# EAGLE design fpc (EAGLE 7.4.0)
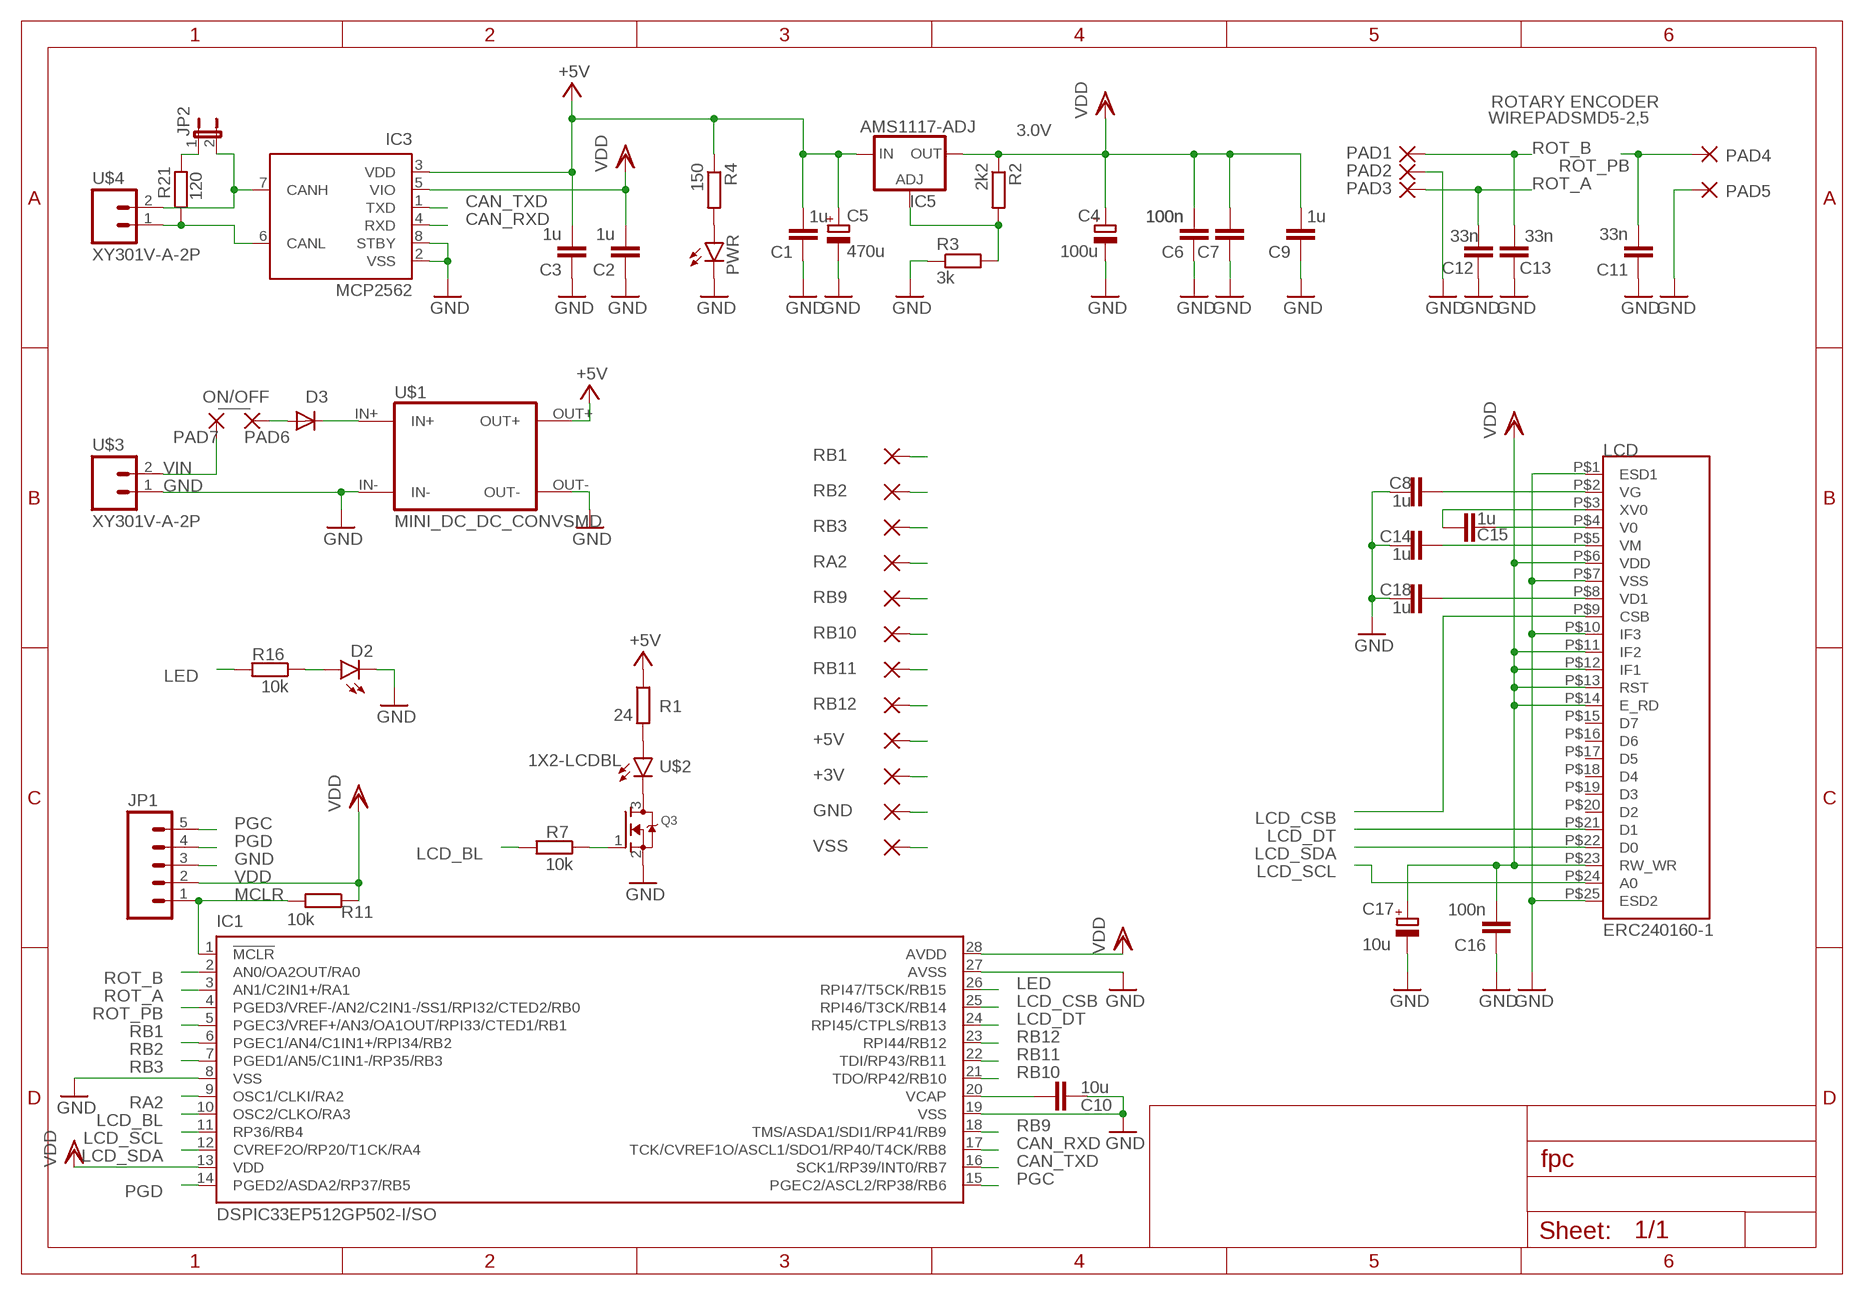
[diagram p0: schematic, sheet 1]

## Parts
+3V  WIREPADSMD1,27-254  [SMD1,27-2,54]
+5V  WIREPADSMD1,27-254  [SMD1,27-2,54]
C1  1u  C-EUC0603K  [C0603K]
C2  1u  C-EUC0603K  [C0603K]
C3  1u  C-EUC0603K  [C0603K]
C4  100u  CPOL-EUSANYO_SMD_B6  [SANYO-OSCON_SMD_B6]
C5  470u  CPOL-EUSANYO_SMD_B6  [SANYO-OSCON_SMD_B6]
C6  100n  C-EUC0603K  [C0603K]
C7  100n  C-EUC0603K  [C0603K]
C8  1u  C-EUC0603K  [C0603K]
C9  1u  C-EUC0603K  [C0603K]
C10  10u  C-EUC0805  [C0805]
C11  33n  C-EUC0603K  [C0603K]
C12  33n  C-EUC0603K  [C0603K]
C13  33n  C-EUC0603K  [C0603K]
C14  1u  C-EUC0603K  [C0603K]
C15  1u  C-EUC0603K  [C0603K]
C16  100n  C-EUC0603K  [C0603K]
C17  10u  CPOL-EUSANYO_SMD_E12  [SANYO-OSCON_SMD_E12]
C18  1u  C-EUC0603K  [C0603K]
D2  LED-FKIT-1206  [FKIT-LED-1206]
D3  DIODESMA  [SMADIODE]
GND  WIREPADSMD1,27-254  [SMD1,27-2,54]
IC1  DSPIC33EP512GP502-I/SO  [SO28W]
IC3  MCP2562  MCP2562-E/SN  [SO-08]
IC5  AMS1117-ADJ  LD117AS33TR  [SOT223]
JP1  M05PTH  [1X05]
JP2  JP1E  [JP1]
LCD  ERC240160-1  [1X25-LCDFPC-SMD]
PAD1  WIREPADSMD5-2,5  [5-2,5]
PAD2  WIREPADSMD5-2,5  [5-2,5]
PAD3  WIREPADSMD5-2,5  [5-2,5]
PAD4  WIREPADSMD5-2,5  [5-2,5]
PAD5  WIREPADSMD5-2,5  [5-2,5]
PAD6  WIREPADSMD5-2,5  [5-2,5]
PAD7  WIREPADSMD5-2,5  [5-2,5]
PWR  LED-FKIT-1206  [FKIT-LED-1206]
Q3  MOSFET-NREFLOW  [SOT23]
R1  24  R-EU_R0805  [R0805]
R2  2k2  R-EU_R0603  [R0603]
R3  3k  R-EU_R0603  [R0603]
R4  150  R-EU_R0603  [R0603]
R7  10k  R-EU_R0603  [R0603]
R11  10k  R-EU_R0603  [R0603]
R16  10k  R-EU_R0603  [R0603]
R21  120  R-EU_R0603  [R0603]
RA2  WIREPADSMD1,27-254  [SMD1,27-2,54]
RB1  WIREPADSMD1,27-254  [SMD1,27-2,54]
RB2  WIREPADSMD1,27-254  [SMD1,27-2,54]
RB3  WIREPADSMD1,27-254  [SMD1,27-2,54]
RB9  WIREPADSMD1,27-254  [SMD1,27-2,54]
RB10  WIREPADSMD1,27-254  [SMD1,27-2,54]
RB11  WIREPADSMD1,27-254  [SMD1,27-2,54]
RB12  WIREPADSMD1,27-254  [SMD1,27-2,54]
U$1  MINI_DC_DC_CONVSMD  [DSN-MINI-360-SMD]
U$2  1X2-LCDBL  [1X2-LCDBL-SMD]
U$3  XY301V-A-2P  [XY301V-A-2P]
U$4  XY301V-A-2P  [XY301V-A-2P]
VSS  WIREPADSMD1,27-254  [SMD1,27-2,54]

## Nets
+5V: +5V.1(P) C1.2 C3.2 C5.+ IC3.3(VDD) IC5.3(IN) R1.1 R4.1 U$1.OUT+
CAN_H: IC3.7(CANH) JP2.2 U$4.2
CAN_L: IC3.6(CANL) R21.1 U$4.1
CAN_RXD: IC1.17(TCK/CVREF1O/ASCL1/SDO1/RP40/T4CK/RB8) IC3.4(RXD)
CAN_TXD: IC1.16(SCK1/RP39/INT0/RB7) IC3.1(TXD)
GND: C1.1 C2.1 C3.1 C4.- C5.- C6.1 C7.1 C8.1 C9.1 C10.1 C11.1 C12.1 C13.1 C14.1 C16.1 C17.- C18.1 D2.C GND.1(P) IC1.8(VSS) IC1.19(VSS) IC1.27(AVSS) IC3.2(VSS) IC3.8(STBY) JP1.3 LCD.P$1(ESD1) LCD.P$7(VSS) LCD.P$10(IF3) LCD.P$25(ESD2) PAD2.1(P) PAD5.1(P) PWR.C Q3.2(S) R3.1 U$1.IN- U$1.OUT- U$3.1 VSS.1(P)
LCD_BL: IC1.10(OSC2/CLKO/RA3) R7.2
LCD_CSB: IC1.25(RPI46/T3CK/RB14) LCD.P$9(CSB)
LCD_DT: IC1.24(RPI45/CTPLS/RB13) LCD.P$21(D1)
LCD_SCL: IC1.11(RP36/RB4) LCD.P$24(A0)
LCD_SDA: IC1.12(CVREF2O/RP20/T1CK/RA4) LCD.P$22(D0)
LED: IC1.26(RPI47/T5CK/RB15) R16.2
MCLR: IC1.1(!MCLR!) JP1.1 R11.2
N$1: Q3.1(G) R7.1
N$2: R1.2 U$2.A
N$3: PWR.A R4.2
N$4: Q3.3(D) U$2.K(C)
N$5: C15.2 LCD.P$4(V0)
N$6: C15.1 LCD.P$3(XV0)
N$7: C8.2 LCD.P$2(VG)
N$8: C14.2 LCD.P$5(VM)
N$9: D2.A R16.1
N$10: C18.2 LCD.P$8(VD1)
N$11: IC5.1(ADJ) R2.2 R3.2
N$12: D3.A PAD6.1(P)
N$13: JP2.1 R21.2
PGC: IC1.15(PGEC2/ASCL2/RP38/RB6) JP1.5
PGD: IC1.14(PGED2/ASDA2/RP37/RB5) JP1.4
RA2: IC1.9(OSC1/CLKI/RA2) RA2.1(P)
RB1: IC1.5(PGEC3/VREF+/AN3/OA1OUT/RPI33/CTED1/RB1) RB1.1(P)
RB2: IC1.6(PGEC1/AN4/C1IN1+/RPI34/RB2) RB2.1(P)
RB3: IC1.7(PGED1/AN5/C1IN1-/RP35/RB3) RB3.1(P)
RB9: IC1.18(TMS/ASDA1/SDI1/RP41/RB9) RB9.1(P)
RB10: IC1.21(TDO/RP42/RB10) RB10.1(P)
RB11: IC1.22(TDI/RP43/RB11) RB11.1(P)
RB12: IC1.23(RPI44/RB12) RB12.1(P)
ROT_A: C12.2 IC1.3(AN1/C2IN1+/RA1) PAD3.1(P)
ROT_B: C13.2 IC1.2(AN0/OA2OUT/RA0) PAD1.1(P)
ROT_PB: C11.2 IC1.4(PGED3/VREF-/AN2/C2IN1-/SS1/RPI32/CTED2/RB0) PAD4.1(P)
VCAP: C10.2 IC1.20(VCAP)
VDD: +3V.1(P) C2.2 C4.+ C6.2 C7.2 C9.2 C16.2 C17.+ IC1.13(VDD) IC1.28(AVDD) IC3.5(VIO) IC5.2(OUT) IC5.@2(OUT) JP1.2 LCD.P$6(VDD) LCD.P$11(IF2) LCD.P$12(IF1) LCD.P$13(RST) LCD.P$14(E_RD) LCD.P$23(RW_WR) R2.1 R11.1
VIN: PAD7.1(P) U$3.2
VIN_D: D3.C U$1.IN+
Unconnected: LCD.P$15(D7) LCD.P$16(D6) LCD.P$17(D5) LCD.P$18(D4) LCD.P$19(D3) LCD.P$20(D2)

## Notes on the sheet
- ROTARY ENCODER
- 3.0V
- ON/OFF

## Library data of the parts
+3V +5V GND PAD1-PAD7 RA2 RB1-RB3 RB9-RB12 VSS = wirepad:WIREPAD: Wire PAD connect wire on PCB
C1-C3 C6-C16 C18 = rcl:C-EU: CAPACITOR, European symbol
C4 C5 C17 = rcl:CPOL-EU: POLARIZED CAPACITOR, European symbol
D2 PWR = SparkFun-LED:LED: LEDs Standard schematic elements and footprints for 5mm, 3mm, 1206, and 0603 sized LEDs. 5mm - Spark Fun Electronics SKU : COM-00529 (and others)
D3 = adafruit:DIODE: Diode SMADIODE - SMA Surface Mount Package 20V 1A Schottky Diode Digikey: 641-1014-6-ND DO-1N4148 - Through Hole Small Current Diode SOD-123 20V 1 A (.5mV Vf) Schottky Diode - Digikey: MBRX120TPMSCT-ND SOD-323 10V 570mA (.38mV Vf, 3ns) Schottky Diode - Digikey: ZLLS410CT-ND SOD-523 30V 30mA Schottky Diode (RB751S-40TE61) - Digikey: RB751S-40TE61CT-ND SOT23-R/W - SOT23 Package (R = Solder Paste/Reflow Ovens, W = Hand-Soldering) BAT54Film 40V 300mA - Digikey: 497-7162-1-ND
IC1 = microchip:DSPIC33EP*502?: 16-Bit Microcontrollers and Digital Signal Controllers with High-Speed PWM, Op Amps and Advanced Analog Source: ww1.microchip.com/downloads/en/DeviceDoc/70000657H.pdf
IC3 = microchip:MCP2562: High-Speed CAN Transceiver Source: http://ww1.microchip.com/downloads/en/DeviceDoc/20005167C.pdf
IC5 = v-reg:LD117A?*: Low drop fixed and adjustable positive voltage regulators 1 A Source: http://www.st.com/stonline/products/literature/ds/7194/ld1117axx.pdf
JP1 = SparkFun-Connectors:M05: Header 5 Standard 5-pin 0.1" header. Use with straight break away headers (SKU : PRT-00116), right angle break away headers (PRT-00553), swiss pins (PRT-00743), machine pins (PRT-00117), and female headers (PRT-00115). Molex polarized connector foot print use with SKU : PRT-08230 with associated crimp pins and housings.
JP2 = jumper:JP1E: JUMPER
LCD = aliexpress_modules:ERC240160-1
Q3 = adafruit:MOSFET-N: N-Channel Mosfet 2N7002E - 60V 260mA SOT23 [Digikey: 2N7002ET1GOSTR-ND] - REEL BSH103 - 30V 850mA SOT23 [Digikey: 568-5013-1-ND]
R1-R4 R7 R11 R16 R21 = rcl:R-EU_: RESISTOR, European symbol
U$1 = aliexpress_modules:MINI_DC_DC_CONV: RC Airplane Module Mini 360 DC Buck Converter Step Down Module 4.75V-23V to 1V-17V 17x11x3.8mm New LM2596; $1.06 Input voltage: 4.75V-23V; Output voltage: 1.0V-17V; Current output: peak 3A, 1.8A long time
U$2 = aliexpress_modules:1X2-LCDBL
U$3 U$4 = aliexpress_modules:XY301V-A-2P: 10mm screw terminal 2 pin; blue with 5mm pitch

## Board
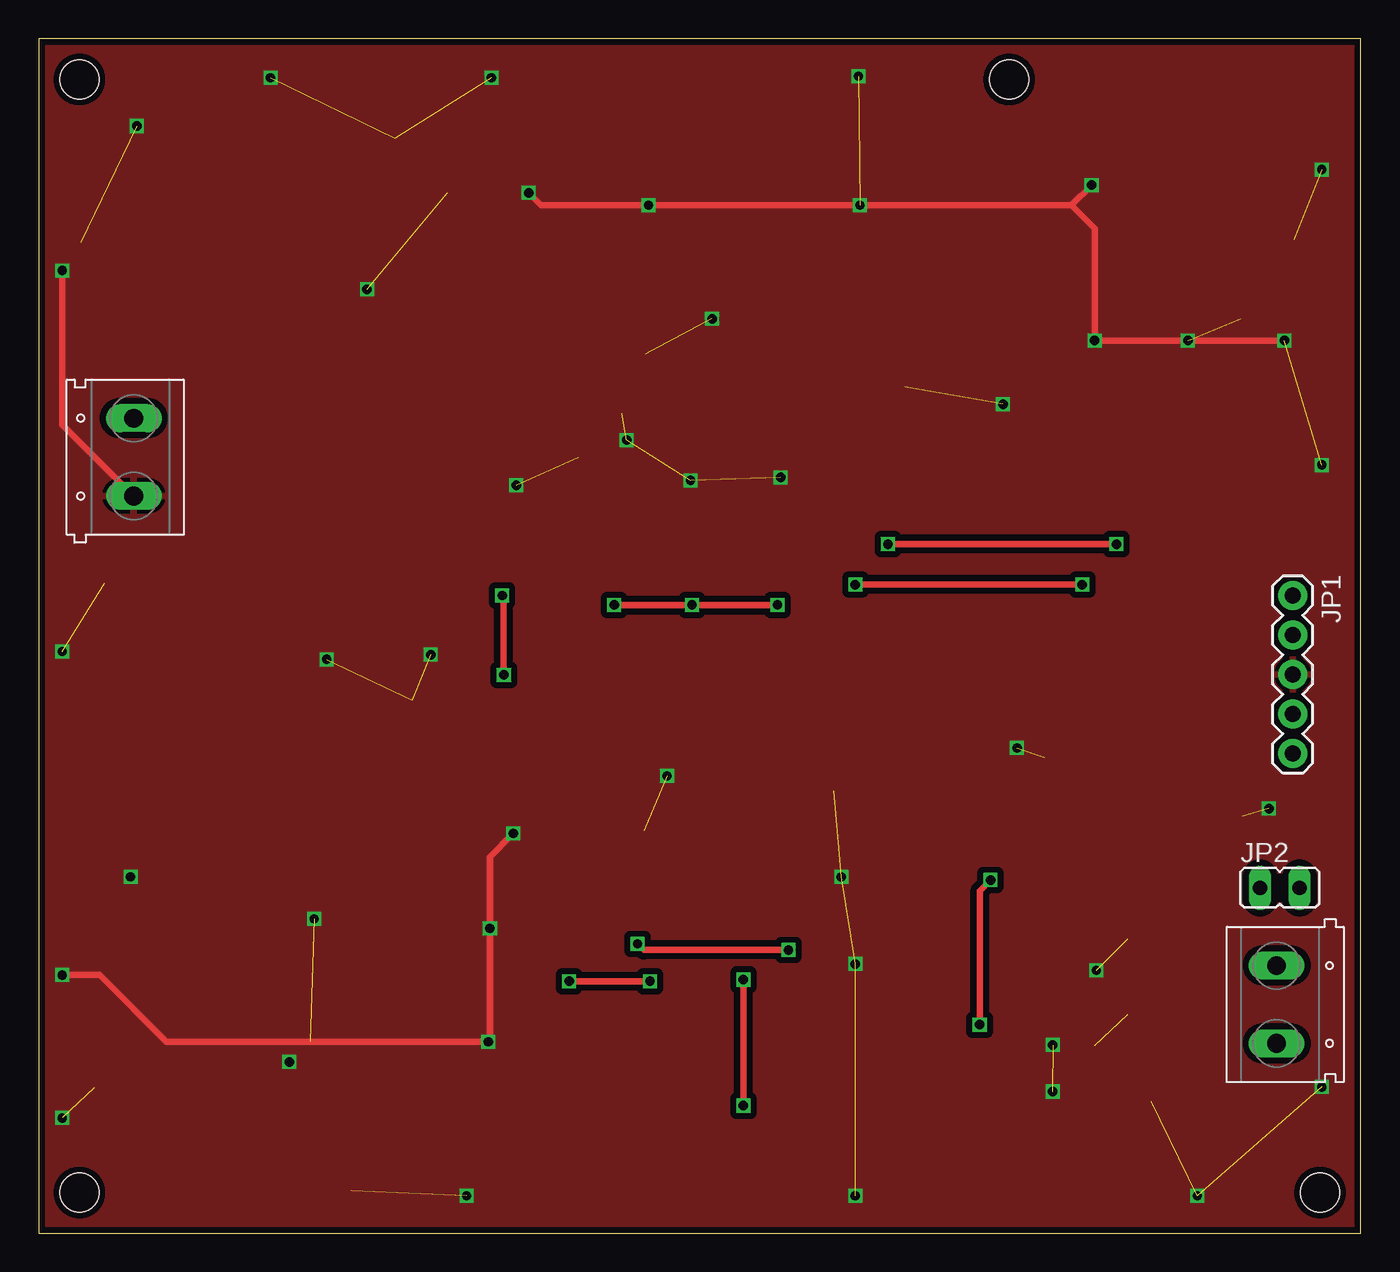
[diagram p1: board, top side]
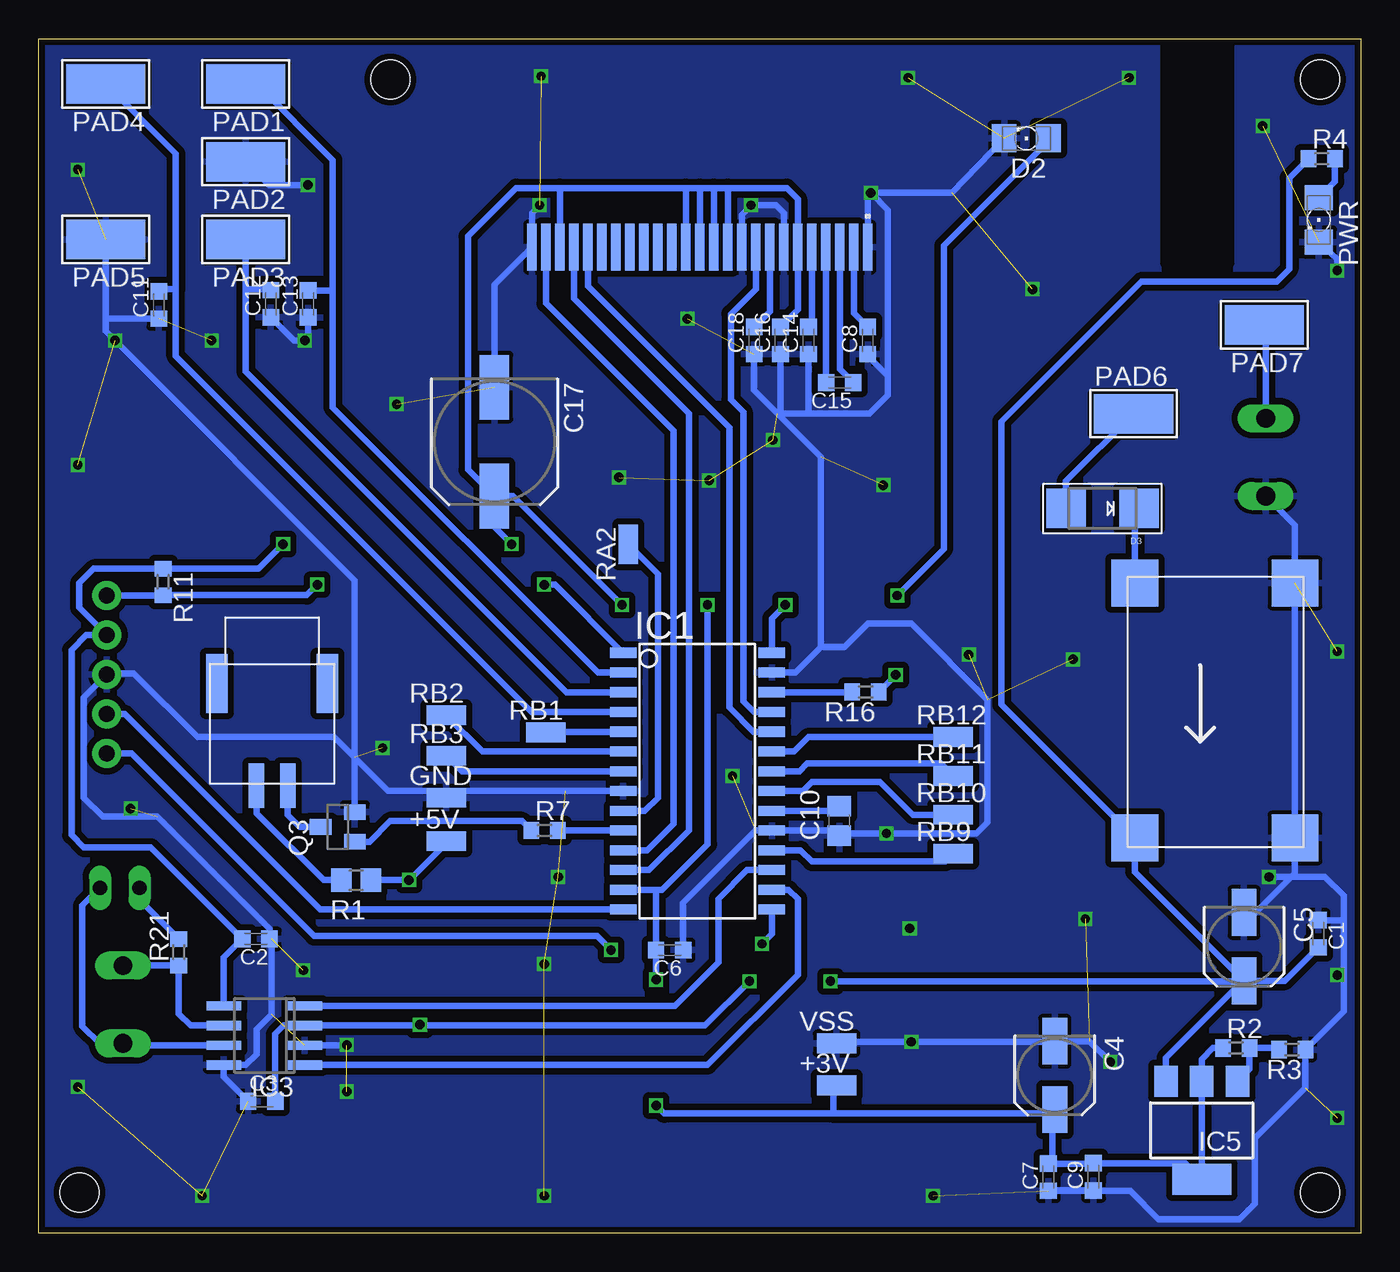
[diagram p2: board, bottom side, seen from below]

Size 85 x 76.8 mm. Coordinates in mm from the lower left corner, seen from the top.
Outline: 0,0 85,0 85,76.8 0,76.8 0,0
Copper layers (1*16): Top 0.035mm / dielectric 1.5mm / Bottom 0.035mm
Design rules "ITEAD_DRU_CHECK": minimum track width 6mil, minimum drill 12mil, track to track 6mil, track to pad 6mil, pad to pad 6mil, via to via 6mil, smd to smd 0mil, copper to edge 10mil, drill to drill 10mil, minimum pad ring 10mil, minimum via ring 6mil, stop-mask expansion 2mil, vias tented up to drill 100mil, thermal gap 10mil
Holes 2.5 mm at 2.6,74.2 62.4,74.2 82.4,2.6 2.6,2.6
tKeepout: area 0.8,72.4 to 4.4,76; area 60.6,72.4 to 64.2,76; area 80.6,0.8 to 84.2,4.4; area 0.8,0.8 to 4.4,4.4
bKeepout: area -0.4,71.2 to 5.6,77.2; area 59.4,71.2 to 65.4,77.2; area 79.4,-0.4 to 85.4,5.6; area -0.4,-0.4 to 5.6,5.6; area 5.6,62.4 to 15.5,77.2; area 82.5,62.4 to 85.4,77.2; area 69.6,62.4 to 72.5,77.2
bRestrict: area 8.5,62.4 to 12.5,77.2

### Footprints (pad centres in the part's own frame; a part is rotated, then mirrored left to right if it is on the bottom)
SMD1,27-2,54 = smd 1.27 x 2.54: 1 0,0
C0603K = smd 1.05 x 1.08: 1 -0.875,0; 2 0.875,0
SANYO-OSCON_SMD_B6 = smd 3 x 1.6: + 2.2,0; - -2.2,0
C0805 = smd 1.3 x 1.5: 1 -0.95,0; 2 0.95,0
SANYO-OSCON_SMD_E12 = smd 4.15 x 1.9: + 3.5,0; - -3.5,0
FKIT-LED-1206 = smd 1.6 x 1.803: A -1.422,0; C 1.422,0
SMADIODE = smd 2.54 x 2.54: A 2.349,0; C -2.349,0
SO28W = smd 0.65 x 1.7: 1 -7.62,-4.78; 2 -6.35,-4.78; 3 -5.08,-4.78; 4 -3.81,-4.78; 5 -2.54,-4.78; 6 -1.27,-4.78; 7 0,-4.78; 8 1.27,-4.78; 9 2.54,-4.78; 10 3.81,-4.78; 11 5.08,-4.78; 12 6.35,-4.78; 13 7.62,-4.78; 14 8.89,-4.78; 15 8.89,4.78; 16 7.62,4.78; 17 6.35,4.78; 18 5.08,4.78; 19 3.81,4.78; 20 2.54,4.78; 21 1.27,4.78; 22 0,4.78; 23 -1.27,4.78; 24 -2.54,4.78; 25 -3.81,4.78; 26 -5.08,4.78; 27 -6.35,4.78; 28 -7.62,4.78
SO-08 = smd 0.6 x 2.2: 1 -1.905,-2.6; 2 -0.635,-2.6; 3 0.635,-2.6; 4 1.905,-2.6; 5 1.905,2.6; 6 0.635,2.6; 7 -0.635,2.6; 8 -1.905,2.6
SOT223 = smd 1.5 x 2: 1 -2.3,-3.15; 2 0,-3.15; 3 2.3,-3.15 | smd 3.8 x 2: @2 0,3.15
1X05 = drill 1.016 pad 1.88: 1 0,0; 2 2.54,0; 3 5.08,0; 4 7.62,0; 5 10.16,0
JP1 = drill 0.914 long: 1 0,-1.27; 2 0,1.27
1X25-LCDFPC-SMD = smd 0.6 x 3: P$1 10.8,0; P$2 9.9,0; P$3 9,0; P$4 8.1,0; P$5 7.2,0; P$6 6.3,0; P$7 5.4,0; P$8 4.5,0; P$9 3.6,0; P$10 2.7,0; P$11 1.8,0; P$12 0.9,0; P$13 0,0; P$14 -0.9,0; P$15 -1.8,0; P$16 -2.7,0; P$17 -3.6,0; P$18 -4.5,0; P$19 -5.4,0; P$20 -6.3,0; P$21 -7.2,0; P$22 -8.1,0; P$23 -9,0; P$24 -9.9,0; P$25 -10.8,0
5-2,5 = smd 2.54 x 5.08: 1 0,0
SOT23 = smd 1 x 1.4: 1 -0.95,-1.1; 2 0.95,-1.1; 3 0,1.1
R0805 = smd 1.3 x 1.5: 1 -0.95,0; 2 0.95,0
R0603 = smd 1 x 1.1: 1 -0.85,0; 2 0.85,0
DSN-MINI-360-SMD = smd 3 x 3: IN+ 8.3,5.2; IN- 8.3,-5.1; OUT+ -8.1,5.2; OUT- -8.1,-5.1
1X2-LCDBL-SMD = smd 1 x 2.85: A -1,-1.425; K 1,-1.425 | smd 1.4 x 3.8: P$3 3.55,5.15; P$4 -3.55,5.15
XY301V-A-2P = drill 1.2 long: 1 -2.5,0; 2 2.5,0

### Placement (x,y rotation side)
+3V  33.7,9.5 270 bottom
+5V  58.8,25.2 270 bottom
C1  2.72,19.25 270 bottom
C2  71.04,18.92 180 bottom
C3  70.67,8.48 0 bottom
C4  19.67,10.14 270 bottom
C5  7.5,18.42 270 bottom
C6  44.44,18.2 180 bottom
C7  20.08,3.59 90 bottom
C8  31.7,57.4 90 bottom
C9  17.18,3.62 90 bottom
C10  33.53,26.51 90 bottom
C11  77.28,59.68 90 bottom
C12  70.08,59.77 90 bottom
C13  67.68,59.76 90 bottom
C14  35.5,57.4 90 bottom
C15  33.5,54.7 180 bottom
C16  37.3,57.4 90 bottom
C17  55.7,50.9 270 bottom
C18  39,57.4 90 bottom
D2  21.5,70.4 180 bottom
D3  16.6,46.6 180 bottom
GND  58.8,28 270 bottom
IC1  42.65,29.7 270 bottom
IC3  70.5,12.71 90 bottom
IC5  10.22,6.6 180 bottom
JP1  80.63,41 270 top
JP2  79.8,22.2 270 top
LCD  42.5,63.4 0 bottom
PAD1  71.7,73.9 90 bottom
PAD2  71.7,68.9 90 bottom
PAD3  71.7,63.9 90 bottom
PAD4  80.7,73.9 90 bottom
PAD5  80.7,63.9 90 bottom
PAD6  14.6,52.7 270 bottom
PAD7  6.2,58.4 90 bottom
PWR  2.69,65.16 270 bottom
Q3  65.78,26.12 90 bottom
R1  64.6,22.7 180 bottom
R2  8,11.9 0 bottom
R3  4.4,11.8 180 bottom
R4  2.5,69.1 0 bottom
R7  52.48,25.9 0 bottom
R11  77,41.88 270 bottom
R16  31.84,34.8 180 bottom
R21  76,18.06 90 bottom
RA2  47.1,44.3 0 bottom
RB1  52.4,32.2 270 bottom
RB2  58.8,33.3 270 bottom
RB3  58.8,30.7 270 bottom
RB9  26.2,24.4 270 bottom
RB10  26.2,26.9 270 bottom
RB11  26.2,29.4 270 bottom
RB12  26.2,31.9 270 bottom
U$1  9.32,33.51 90 bottom
U$2  70,30.2 0 bottom
U$3  6.1,49.9 90 top
U$4  79.6,14.7 270 top
VSS  33.7,12.2 270 bottom

### Tracks (layer width: path | path; a pad name or v marks a point on that pad's centre or on a via)
+5V  (via drill 0.6)
  Top 0.406: v60.5,13.4 60.5,22 v61.2,22.7 | v39.3,16.2 v34.1,16.2
  Bottom 0.406: R4.1 4.6,67.85 4.6,62 5.4,61.2 14.1,61.2 23.1,52.2 23.1,33.99 U$1.OUT+ 14.52,23.24 C5.+ | IC5.3 12.52,11.28 7.58,16.22 C5.+ | +5V.1 58.8,25.05 61.15,22.7 v61.2,22.7 R1.1 | C3.2 69.8,10.17 69.8,12.8 69.25,13.34 IC3.3 60.7,13.34 | 60.7,13.34 42.16,13.34 v39.3,16.2 | v60.5,13.4 60.64,13.4 60.7,13.34 | v34.1,16.2 7.52,16.2 C5.+ | C5.+ 4.88,16.22 C1.2
CAN_H
  Bottom 0.406: IC3.7 79.47,12.07 U$4.2 81.1,12.2 82.2,13.3 82.2,21.07 JP2.2
CAN_L
  Bottom 0.406: U$4.1 R21.1 76,14.1 75.25,13.34 IC3.6
CAN_RXD
  Bottom 0.406: IC3.4 44.09,14.61 41.3,17.4 41.3,21.5 39.45,23.35 IC1.17
CAN_TXD
  Bottom 0.406: IC3.1 41.99,10.8 36.2,16.6 36.2,21.5 36.78,22.08 IC1.16 37.89,22.1
GND  (via drill 0.6)  (31 unrouted)
  Top 0.406: v31.5,66.9 32.3,66.1 v39.2,66.1 v52.8,66.1 66.4,66.1 | v1.5,61.9 1.5,52 U$3.1 | v67.7,67.4 66.4,66.1 | 66.4,66.1 67.9,64.6 v67.9,57.4 v80.1,57.4 | v30.5,25.7 29,24.2 v29,19.6 29,12.4 v28.9,12.3 8.2,12.3 3.9,16.6 v1.5,16.6
  Bottom 0.406: LCD.P$10 39.8,65.5 v39.2,66.1 37.6,66.1 37.1,65.6 LCD.P$7 | v31.5,66.9 31.7,66.7 LCD.P$1 | v52.8,66.1 53.3,65.6 LCD.P$25 55.7,61 C17.- | PWR.C 1.5,62.65 v1.5,61.9 | C8.1 31.7,56.4 30.4,55.1 | 30.4,55.1 30.4,53.9 31.6,52.7 35.5,52.7 | 35.5,52.7 37.3,52.7 | 37.3,52.7 37.5,52.7 | 37.5,52.7 39,54.2 C18.1 | C16.1 37.3,52.7 | C14.1 35.5,52.7 | v31.5,66.9 30.4,65.8 30.4,55.1 | D2.C 26.27,66.9 v31.5,66.9 | PAD2.1 70.2,67.4 v67.7,67.4 | C13.1 67.68,57.62 v67.9,57.4 68.59,57.4 C12.1 | 37.5,52.7 34.7,49.9 34.7,37.7 | IC1.27 36.35,36.05 34.7,37.7 | U$3.1 4.22,45.52 U$1.IN- U$1.OUT- 4.22,23.14 4.46,22.9 | C9.1 20.05,2.74 C7.1 14.82,2.71 13,0.9 7.8,0.9 6.8,1.9 6.8,6.1 3.55,9.35 R3.1 1.1,14.25 1.1,16.6 | Q3.2 64.68,30.58 | 64.68,30.58 66,31.9 74.8,31.9 78.9,36 80.55,36 JP1.3 82.1,34.45 82.1,28 80.9,26.8 77.4,26.8 70.16,19.56 C2.1 70.02,18.92 70.02,14.08 71,13.1 71,11.5 71.69,10.8 IC3.8 73.1,10.04 C3.1 | 59,28.43 IC1.8 51.13,28.43 | 59,28.43 62.53,28.43 64.68,30.58 | C6.1 43.56,21.23 38.91,25.89 IC1.19 33.86,25.89 C10.1 33.39,25.7 v30.5,25.7 24.7,25.7 24,26.4 24,34.3 28.9,39.2 31.7,39.2 33.2,37.7 34.7,37.7 | 80.7,58.8 80.7,58 v80.1,57.4 64.68,41.98 64.68,30.58 | 80.7,58.8 PAD5.1 | C11.1 80.7,58.8 | GND.1 59,28.2 59,28.43 | VSS.1 33.6,12.3 v28.9,12.3 19.71,12.3 arc-90 C4.- 17.44,12.34 v16.1,11 | IC3.2 65.22,12.07 v65.2,12.1 | 4.46,22.9 6.74,20.62 C5.- | 4.46,22.9 v5.9,22.9 | 4.46,22.9 2.3,22.9 1.1,21.7 1.1,20.2 | 1.1,20.2 1.1,16.6 | v1.5,16.6 1.1,16.6 | C1.1 1.17,20.12 1.1,20.2
  other vias: 65.2,9.1 68,16.9 51.6,22.9 29.1,74.3 52.7,74.4 74.5,2.4 27.5,2.4 1.5,7.4 1.5,37.4 21.1,60.7 30.7,48.1 52.5,2.4 62.9,31.2 82.5,49.4 47.7,48.6 73.9,57.4 6.3,71.2 18.5,36.9 82.5,68.4 17.7,20.2 52.5,17.3 62,53.3 37.8,51 25.2,37.2 82.5,9.4 79.1,27.3 40.4,29.4 14.9,74.3 43.3,58.8 41.9,48.4
  pour Top (isolate 0.406): 0,76.8 0,0 85,0 85,76.8
  pour Bottom (isolate 0.406): 0,76.8 0,0 85,0 85,76.8
LCD_BL
  Bottom 0.406: IC1.10 R7.2
LCD_CSB
  Bottom 0.406: LCD.P$9 38.9,60.7 40.5,59.1 40.5,53.6 39.7,52.8 39.7,34.2 39.01,33.51 IC1.25
LCD_DT
  Bottom 0.406: LCD.P$21 49.7,60.9 40.6,51.8 40.6,33.8 39.04,32.24 IC1.24
LCD_SCL
  Bottom 0.406: LCD.P$24 52.4,59.8 44.2,51.6 44.2,26.3 45.88,24.62 IC1.11
LCD_SDA
  Bottom 0.406: LCD.P$22 50.6,60.1 43.2,52.7 43.2,25.9 45.75,23.35 IC1.12
LED
  Bottom 0.406: IC1.26 32.69,34.78 R16.2
MCLR  (via drill 0.6)
  Top 0.406: v67.1,41.7 v52.5,41.7
  Bottom 0.406: 47.4,37.35 IC1.1 51.81,41.7 v52.5,41.7 | JP1.1 77.03,41 R11.2 67.77,41.03 v67.1,41.7
N$1
  Bottom 0.406: 64.61,25.1 Q3.1 63.73,25.17 62.4,26.5 53.93,26.5 R7.1
N$2
  Bottom 0.406: U$2.A 71,27 66.7,22.7 R1.2
N$3
  Bottom 0.406: PWR.A 1.65,67.62 R4.2
N$4
  Bottom 0.406: Q3.3 68.22,26.12 69,26.9 U$2.K
N$5
  Bottom 0.406: LCD.P$4 34.4,54.72 C15.2
N$6
  Bottom 0.406: LCD.P$3 33.5,55.58 C15.1
N$7
  Bottom 0.406: LCD.P$2 32.6,59.17 C8.2
N$8
  Bottom 0.406: LCD.P$5 35.3,58.47 C14.2
N$9  (via drill 0.6)  (1 unrouted)
  Top 0.406: v29.9,35.9 29.9,41 v29.8,41
  Bottom 0.406: v29.8,41 26.8,44 26.8,63.5 20.23,70.07 D2.A | v29.9,35.89 R16.1
N$10
  Bottom 0.406: LCD.P$8 38,59.27 C18.2
N$11
  Bottom 0.406: R3.2 5.35,11.9 R2.2 7.15,10.52 IC5.1
N$12
  Bottom 0.406: PAD6.1 18.95,48.35 D3.A
N$13
  Bottom 0.406: R21.2 78.53,21.44 JP2.1
PGC  (via drill 0.6)
  Top 0.406: v48.2,18.2 38.9,18.2 v38.5,18.6
  Bottom 0.406: JP1.5 79.04,30.84 67.3,19.1 49.1,19.1 v48.2,18.2 | v38.5,18.6 37.87,19.23 IC1.15
PGD
  Bottom 0.406: JP1.4 79.48,33.38 66.91,20.81 IC1.14
RA2
  Bottom 0.406: IC1.9 46.04,27.16 45.2,28 45.2,42.4 RA2.1
RB1
  Bottom 0.406: IC1.5 52.36,32.24 RB1.1
RB2
  Bottom 0.406: IC1.6 56.47,30.97 RB2.1
RB3
  Bottom 0.406: IC1.7 57.8,29.7 RB3.1
RB9
  Bottom 0.406: IC1.18 36.02,24.62 35.3,23.9 26.7,23.9 RB9.1
RB10
  Bottom 0.406: IC1.21 35.87,28.43 35.3,29 30.9,29 28.8,26.9 RB10.1
RB11
  Bottom 0.406: IC1.22 36.1,29.7 35.6,30.2 27,30.2 RB11.1
RB12
  Bottom 0.406: IC1.23 36.43,30.97 35.5,31.9 RB12.1
ROT_A
  Bottom 0.406: PAD3.1 71.7,60.7 | C12.2 70.14,60.7 71.7,60.7 | 71.7,60.7 71.7,55.4 51.08,34.78 IC1.3
ROT_B
  Bottom 0.406: PAD1.1 71,73.9 66.1,69 66.1,60.6 | 66.1,60.6 66.1,53.1 49.05,36.05 IC1.2 | C13.2 67.64,60.6 66.1,60.6
ROT_PB
  Bottom 0.406: PAD4.1 76.2,69.4 76.2,60.7 | C11.2 77.13,60.7 76.2,60.7 | IC1.4 53.31,33.51 76.2,56.4 76.2,60.7
VCAP
  Bottom 0.406: IC1.20 33.83,27.16 C10.2
VDD  (via drill 0.6)
  Top 0.406: v45.3,8.2 v45.3,16.3 | v69.3,44.3 v54.6,44.3 | v37,40.4 v42,40.4 v47.5,40.4
  Bottom 0.406: IC3.5 73.1,17.73 C2.2 77.8,24.8 82.1,24.8 82.9,25.6 82.9,37.5 81.94,38.46 JP1.2 | R2.1 9.5,11.9 10.22,11.18 IC5.2 IC5.@2 11.27,4.49 C9.2 17.21,4.46 C7.2 19.83,4.71 19.83,7.78 C4.+ arc90 19.92,7.69 33.9,7.69 | 37.85,37.3 IC1.28 37.87,39.53 v37,40.4 | 51.5,67.2 54.3,67.2 57.4,64.1 57.4,49.1 C17.+ | 51.5,67.2 43.4,67.2 | 43.4,67.2 42.5,67.2 | 42.5,67.2 41.6,67.2 | 41.6,67.2 40.7,67.2 | 40.7,67.2 36.9,67.2 36.2,66.5 LCD.P$6 36.2,59.38 C16.2 | LCD.P$11 40.7,67.2 | LCD.P$12 41.6,67.2 | LCD.P$13 42.5,67.2 | LCD.P$14 43.4,67.2 | LCD.P$23 51.5,67.2 | JP1.2 | JP1.2 82.4,40.23 82.4,41.8 81.47,42.73 R11.1 70.87,42.73 v69.3,44.3 | IC1.13 45.2,22.08 | 45.2,22.08 44.92,22.08 42,25 v42,40.4 | +3V.1 33.9,9.3 33.9,7.69 | v45.3,16.3 45.3,18.18 C6.2 45.31,21.96 45.2,22.08 | 33.9,7.69 44.79,7.69 v45.3,8.2 | v54.6,44.3 55.7,45.4 C17.+ | C17.+ 54.5,47.4 v47.5,40.4
VIN
  Bottom 0.406: PAD7.1 6.1,58.3 U$3.2
VIN_D
  Bottom 0.406: D3.C 14.52,46.33 U$1.IN+